# Altium schematic sheet schematic.SchDoc
size A3
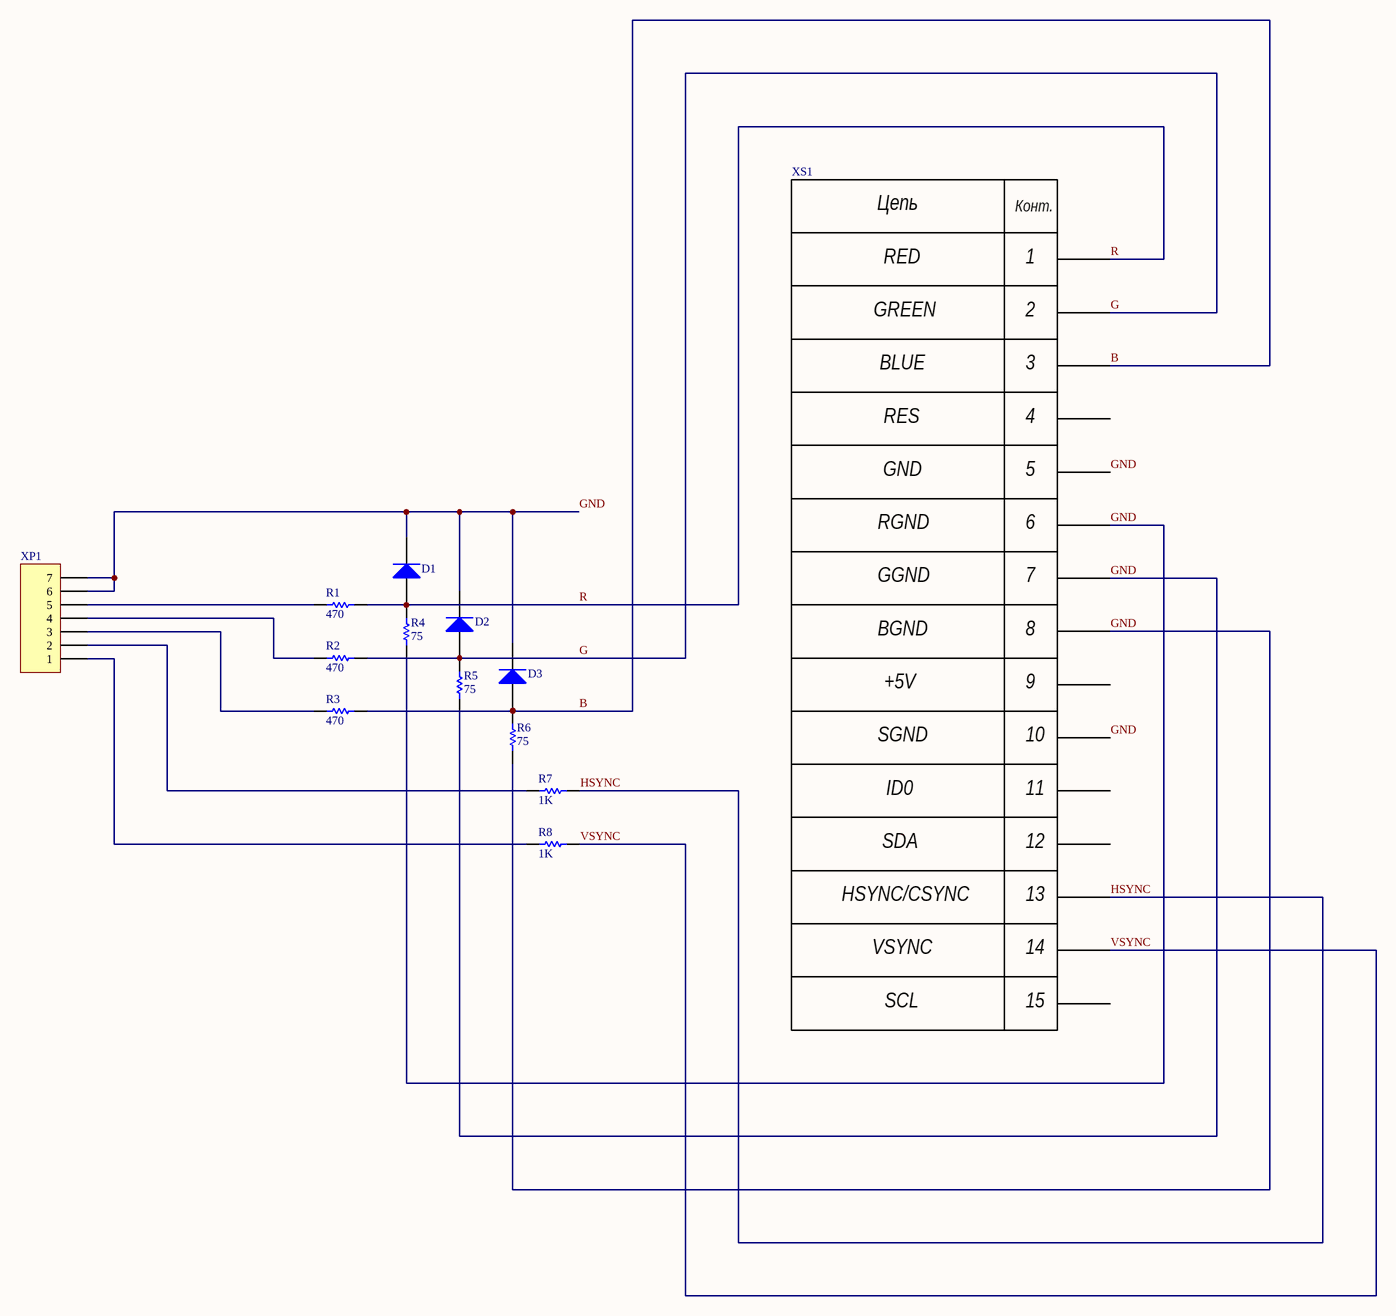
[diagram p0: schematic.SchDoc]

## Parts
D1  Diode 1N4148  [DO-35]  (value not drawn)
D2  Diode 1N4148  [DO-35]  (value not drawn)
D3  Diode 1N4148  [DO-35]  (value not drawn)
R1  470  [AXIAL-0.3]
R2  470  [AXIAL-0.3]
R3  470  [AXIAL-0.3]
R4  75  [AXIAL-0.4]
R5  75  [AXIAL-0.4]
R6  75  [AXIAL-0.4]
R7  1K  [AXIAL-0.3]
R8  1K  [AXIAL-0.3]
XP1  Input Header  [HDR1X7]  (value not drawn)
XS1  D-SUB VGA  [D-SUB VGA]  (value not drawn)

## Nets
B: D3.1(A) R3.2 R6.1 XS1.3
G: D2.1(A) R2.2 R5.1 XS1.2
GND: D1.2(K) D2.2(K) D3.2(K) R4.2 R5.2 R6.2 XP1.6 XP1.7 XS1.5 XS1.6 XS1.7 XS1.8 XS1.10
HSYNC: R7.1 XS1.13
R: D1.1(A) R1.2 R4.1 XS1.1
VSYNC: R8.1 XS1.14
NetR1_1: R1.1 XP1.5
NetR2_1: R2.1 XP1.4
NetR3_1: R3.1 XP1.3
NetR7_2: R7.2 XP1.2
NetR8_2: R8.2 XP1.1

Not connected (* = marked no-connect by the designer): XS1 4 9 11 12 15

## Notes on the sheet
- (in symbol D-SUB VGA) Цепь; Конт.; RED; GREEN; BLUE; RES; GND; RGND; GGND; BGND; +5V; SGND; ID0; SDA; HSYNC/CSYNC; VSYNC; SCL

## Library data of the parts
D1-D3 = Diode 1N4148: High Conductance Fast Diode; Published: 8-Jun-2000; LatestRevisionDate: 17-Jul-2002; LatestRevisionNote: Re-released for DXP Platform.; DatasheetVersion: 1997; PackageReference: DO-35; Publisher: Altium Limited; PackageDescription: Diode, Axial; Body 3.8 x 1.9 mm (LxDia. max), Lead Dia. 0.53 mm (max); Code_JEDEC: DO-204-AH; ComponentLink1Description: Manufacturer Link; ComponentLink1URL: http://www.fairchildsemi.com/; ComponentLink2Description: Datasheet; ComponentLink2URL: http://www.fairchildsemi.com/ds/1N%2F1N4148.pdf
R1-R8 = Res1: Resistor; Published: 8-Jun-2000; LatestRevisionDate: 17-Jul-2002; LatestRevisionNote: Re-released for DXP Platform.; Publisher: Altium Limited; PackageDescription: Axial Device, Thru-Hole; 2 Leads; 0.3 in Pin Spacing
  R1-R3: PackageReference: AXIAL-0.3; Value: 470
  R4-R6: PackageReference: AXIAL-0.4; Value: 75
  R7 R8: PackageReference: AXIAL-0.3; Value: 1K
XP1 = Header 7: Header, 7-Pin; LatestRevisionDate: 17-Jul-2002; LatestRevisionNote: Re-released for DXP Platform.; Publisher: Altium Limited
XS1 = D-SUB VGA: D-SUB VGA Female; LatestRevisionDate: 15-Apr-2015; LatestRevisionNote: Release; Publisher: Victor Grigoryev; PackageDescription: D-SUB; 15 pins female; Datasheet: http://lib.chipdip.ru/244/DOC000244873.pdf